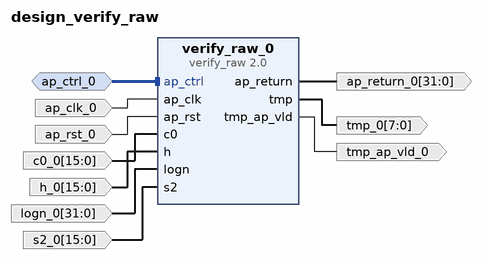
[diagram p0: block diagram of the top level]
# Vivado block design design_verify_raw, xc7a35tcpg236-1, Vivado 2023.2
create_bd_design design_verify_raw

create_bd_intf_port -mode Slave -vlnv xilinx.com:interface:acc_handshake_rtl:1.0 ap_ctrl_0
create_bd_port -dir I -type clk ap_clk_0
create_bd_port -dir O -from 31 -to 0 -type data ap_return_0
create_bd_port -dir I -type rst ap_rst_0
set_property -dict {CONFIG.POLARITY ACTIVE_HIGH} [get_bd_ports ap_rst_0]
create_bd_port -dir I -from 15 -to 0 -type data c0_0
create_bd_port -dir I -from 15 -to 0 -type data h_0
create_bd_port -dir I -from 31 -to 0 -type data logn_0
create_bd_port -dir I -from 15 -to 0 -type data s2_0
create_bd_port -dir O -from 7 -to 0 -type data tmp_0
create_bd_port -dir O tmp_ap_vld_0

create_bd_cell -type ip -vlnv Duy_Nguyen:Falcon_Verify:verify_raw:2.0 verify_raw_0

# ---- connections ----

connect_bd_intf_net -intf_net ap_ctrl_0_1 [get_bd_intf_ports ap_ctrl_0] [get_bd_intf_pins verify_raw_0/ap_ctrl]
connect_bd_net -net ap_clk_0_1 [get_bd_ports ap_clk_0] [get_bd_pins verify_raw_0/ap_clk]
connect_bd_net -net ap_rst_0_1 [get_bd_ports ap_rst_0] [get_bd_pins verify_raw_0/ap_rst]
connect_bd_net -net c0_0_1 [get_bd_ports c0_0] [get_bd_pins verify_raw_0/c0]
connect_bd_net -net h_0_1 [get_bd_ports h_0] [get_bd_pins verify_raw_0/h]
connect_bd_net -net logn_0_1 [get_bd_ports logn_0] [get_bd_pins verify_raw_0/logn]
connect_bd_net -net s2_0_1 [get_bd_ports s2_0] [get_bd_pins verify_raw_0/s2]
connect_bd_net [get_bd_pins verify_raw_0/ap_return] [get_bd_ports ap_return_0]
connect_bd_net [get_bd_pins verify_raw_0/tmp] [get_bd_ports tmp_0]
connect_bd_net [get_bd_pins verify_raw_0/tmp_ap_vld] [get_bd_ports tmp_ap_vld_0]

validate_bd_design
save_bd_design
